# EAGLE design h-Remote (EAGLE 6.3)
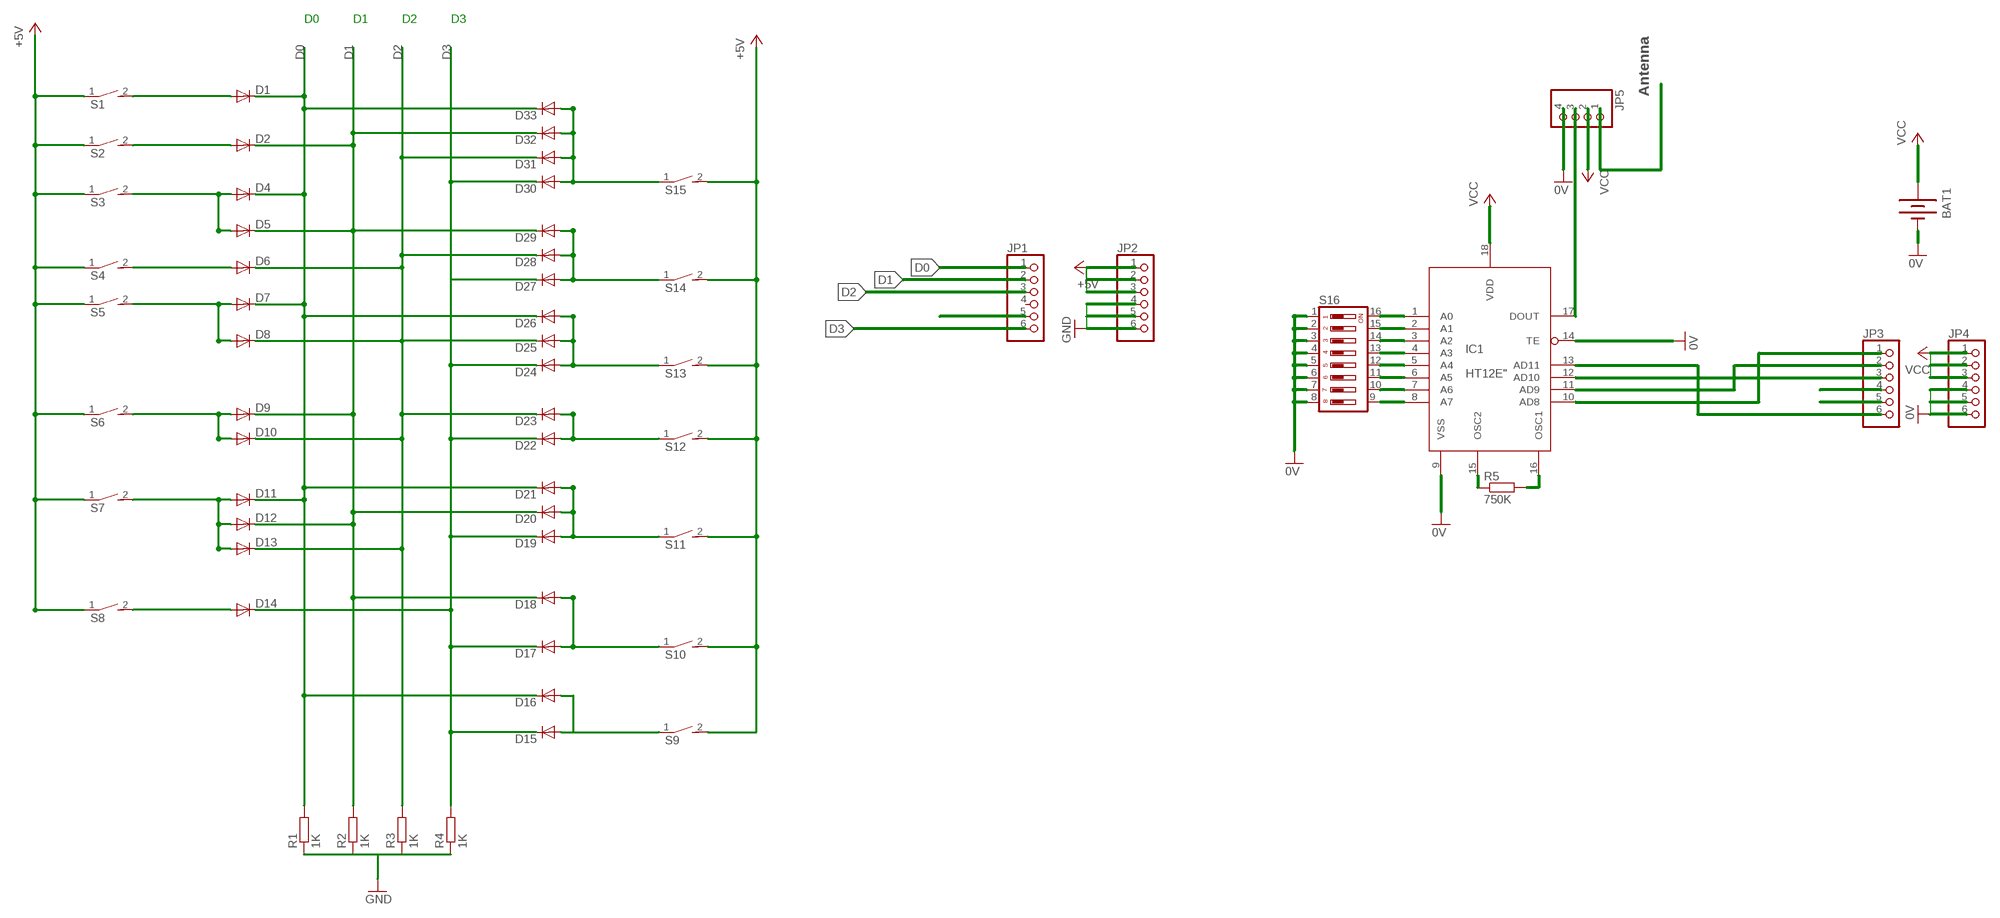
[diagram p0: schematic, sheet 1]

## Parts
BAT1  BATTERY20PTH  [BATTCOM_20MM_PTH]
D1  DIODE-MELF-MLL41  [MELF-MLL41]
D2  DIODE-MELF-MLL41  [MELF-MLL41]
D4  DIODE-MELF-MLL41  [MELF-MLL41]
D5  DIODE-MELF-MLL41  [MELF-MLL41]
D6  DIODE-MELF-MLL41  [MELF-MLL41]
D7  DIODE-MELF-MLL41  [MELF-MLL41]
D8  DIODE-MELF-MLL41  [MELF-MLL41]
D9  DIODE-MELF-MLL41  [MELF-MLL41]
D10  DIODE-MELF-MLL41  [MELF-MLL41]
D11  DIODE-MELF-MLL41  [MELF-MLL41]
D12  DIODE-MELF-MLL41  [MELF-MLL41]
D13  DIODE-MELF-MLL41  [MELF-MLL41]
D14  DIODE-MELF-MLL41  [MELF-MLL41]
D15  DIODE-MELF-MLL41  [MELF-MLL41]
D16  DIODE-MELF-MLL41  [MELF-MLL41]
D17  DIODE-MELF-MLL41  [MELF-MLL41]
D18  DIODE-MELF-MLL41  [MELF-MLL41]
D19  DIODE-MELF-MLL41  [MELF-MLL41]
D20  DIODE-MELF-MLL41  [MELF-MLL41]
D21  DIODE-MELF-MLL41  [MELF-MLL41]
D22  DIODE-MELF-MLL41  [MELF-MLL41]
D23  DIODE-MELF-MLL41  [MELF-MLL41]
D24  DIODE-MELF-MLL41  [MELF-MLL41]
D25  DIODE-MELF-MLL41  [MELF-MLL41]
D26  DIODE-MELF-MLL41  [MELF-MLL41]
D27  DIODE-MELF-MLL41  [MELF-MLL41]
D28  DIODE-MELF-MLL41  [MELF-MLL41]
D29  DIODE-MELF-MLL41  [MELF-MLL41]
D30  DIODE-MELF-MLL41  [MELF-MLL41]
D31  DIODE-MELF-MLL41  [MELF-MLL41]
D32  DIODE-MELF-MLL41  [MELF-MLL41]
D33  DIODE-MELF-MLL41  [MELF-MLL41]
IC1  HT12E"  [18-DIP-A]
JP1  PINHD-1X6  [1X06]
JP2  PINHD-1X6  [1X06]
JP3  PINHD-1X6  [1X06]
JP4  PINHD-1X6  [1X06]
JP5  PINHD-1X4  [1X04]
R1  1K  R-EU_R1206  [R1206]
R2  1K  R-EU_R1206  [R1206]
R3  1K  R-EU_R1206  [R1206]
R4  1K  R-EU_R1206  [R1206]
R5  750K  R-EU_0207/10  [0207/10]
S1  DS01E  [DS-01]
S2  DS01E  [DS-01]
S3  DS01E  [DS-01]
S4  DS01E  [DS-01]
S5  DS01E  [DS-01]
S6  DS01E  [DS-01]
S7  DS01E  [DS-01]
S8  DS01E  [DS-01]
S9  DS01E  [DS-01]
S10  DS01E  [DS-01]
S11  DS01E  [DS-01]
S12  DS01E  [DS-01]
S13  DS01E  [DS-01]
S14  DS01E  [DS-01]
S15  DS01E  [DS-01]
S16  DIP08YL  [DIP08YL]

## Nets
0V: BAT1.2(-) IC1.9(VSS) IC1.14(TE) JP4.4 JP4.5 JP4.6 JP5.4 S16.1 S16.2 S16.3 S16.4 S16.5 S16.6 S16.7 S16.8
+5V: JP2.1 JP2.2 JP2.3 S1.1 S2.1 S3.1 S4.1 S5.1 S6.1 S7.1 S8.1 S9.2 S10.2 S11.2 S12.2 S13.2 S14.2 S15.2
D0: D1.C D4.C D7.C D11.C D16.C D21.C D26.C D33.C JP1.1 R1.2
D1: D2.C D5.C D9.C D12.C D18.C D20.C D29.C D32.C JP1.2 R2.2
D2: D6.C D8.C D10.C D13.C D23.C D25.C D28.C D31.C JP1.3 R3.2
D3: D14.C D15.C D17.C D19.C D22.C D24.C D27.C D30.C JP1.6 R4.2
GND: JP2.4 JP2.5 JP2.6 R1.1 R2.1 R3.1 R4.1
N$2: D7.A D8.A S5.2
N$3: IC1.13(AD11) JP3.6
N$4: IC1.12(AD10) JP3.3
N$5: D2.A S2.2
N$6: IC1.11(AD9) JP3.2
N$7: D6.A S4.2
N$8: D4.A D5.A S3.2
N$9: D1.A S1.2
N$10: D9.A D10.A S6.2
N$11: D11.A D12.A D13.A S7.2
N$12: D14.A S8.2
N$13: D15.A D16.A S9.1
N$14: D17.A D18.A S10.1
N$15: D19.A D20.A D21.A S11.1
N$16: D22.A D23.A S12.1
N$17: D24.A D25.A D26.A S13.1
N$18: D27.A D28.A D29.A S14.1
N$19: D30.A D31.A D32.A D33.A S15.1
N$20: IC1.10(AD8) JP3.1
N$21: IC1.1(A0) S16.16
N$22: IC1.2(A1) S16.15
N$23: IC1.3(A2) S16.14
N$24: JP1.5
N$25: IC1.4(A3) S16.13
N$26: IC1.5(A4) S16.12
N$31: IC1.6(A5) S16.11
N$32: IC1.7(A6) S16.10
N$33: IC1.8(A7) S16.9
N$36: IC1.15(OSC2) R5.1
N$37: IC1.16(OSC1) R5.2
N$42: JP3.4
N$43: JP3.5
N$52: IC1.17(DOUT) JP5.3
N$54: JP5.1
VCC: BAT1.1(+) IC1.18(VDD) JP4.1 JP4.2 JP4.3 JP5.2
Unconnected: JP1.4

## Notes on the sheet
- D0 | D1 | D2 | D3
- Antenna

## Library data of the parts
BAT1 = SparkFun-Electromechanical:BATTERY: Battery Holders Various common sizes : AA, AAA, 18650 (PRT-12895), 20mm coin cell and 12mm coin cell. 20MM_4LEGS, BATT-10373
D1 D2 D4-D33 = diode:DIODE-: DIODE
IC1 = holtek1:HT12E: transmitter = encoder ic
JP1-JP4 = pinhead:PINHD-1X6: PIN HEADER
JP5 = pinhead:PINHD-1X4: PIN HEADER
R1-R5 = rcl:R-EU_: RESISTOR, European symbol
S1-S15 = switch-dil:DS01E: DIL/CODE SWITCH; OC_FARNELL: unknown; OC_NEWARK: unknown
S16 = switch-dil:DIP08YL: DIL/CODE SWITCH; OC_FARNELL: unknown; OC_NEWARK: unknown

## Board
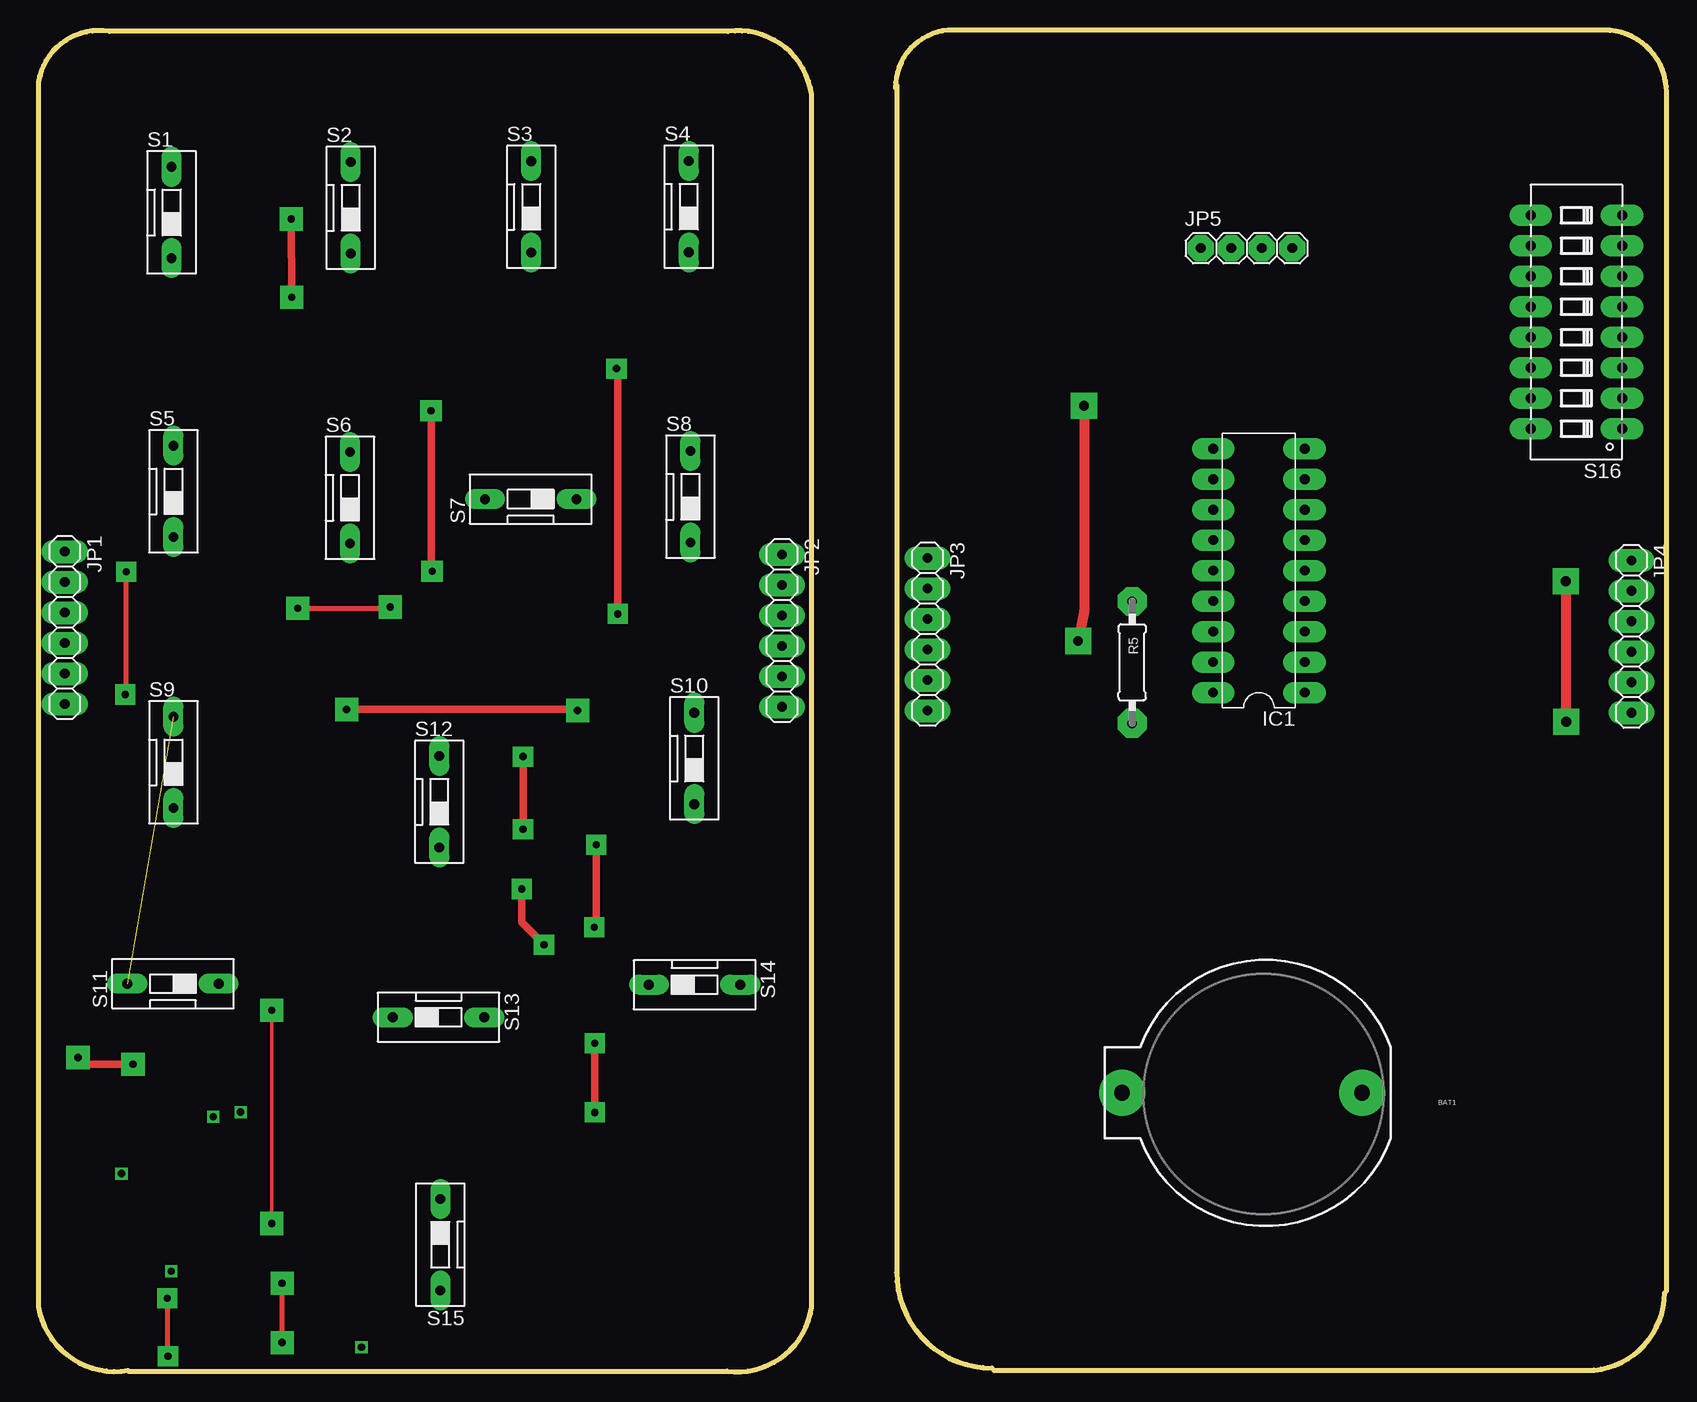
[diagram p1: board, top side]
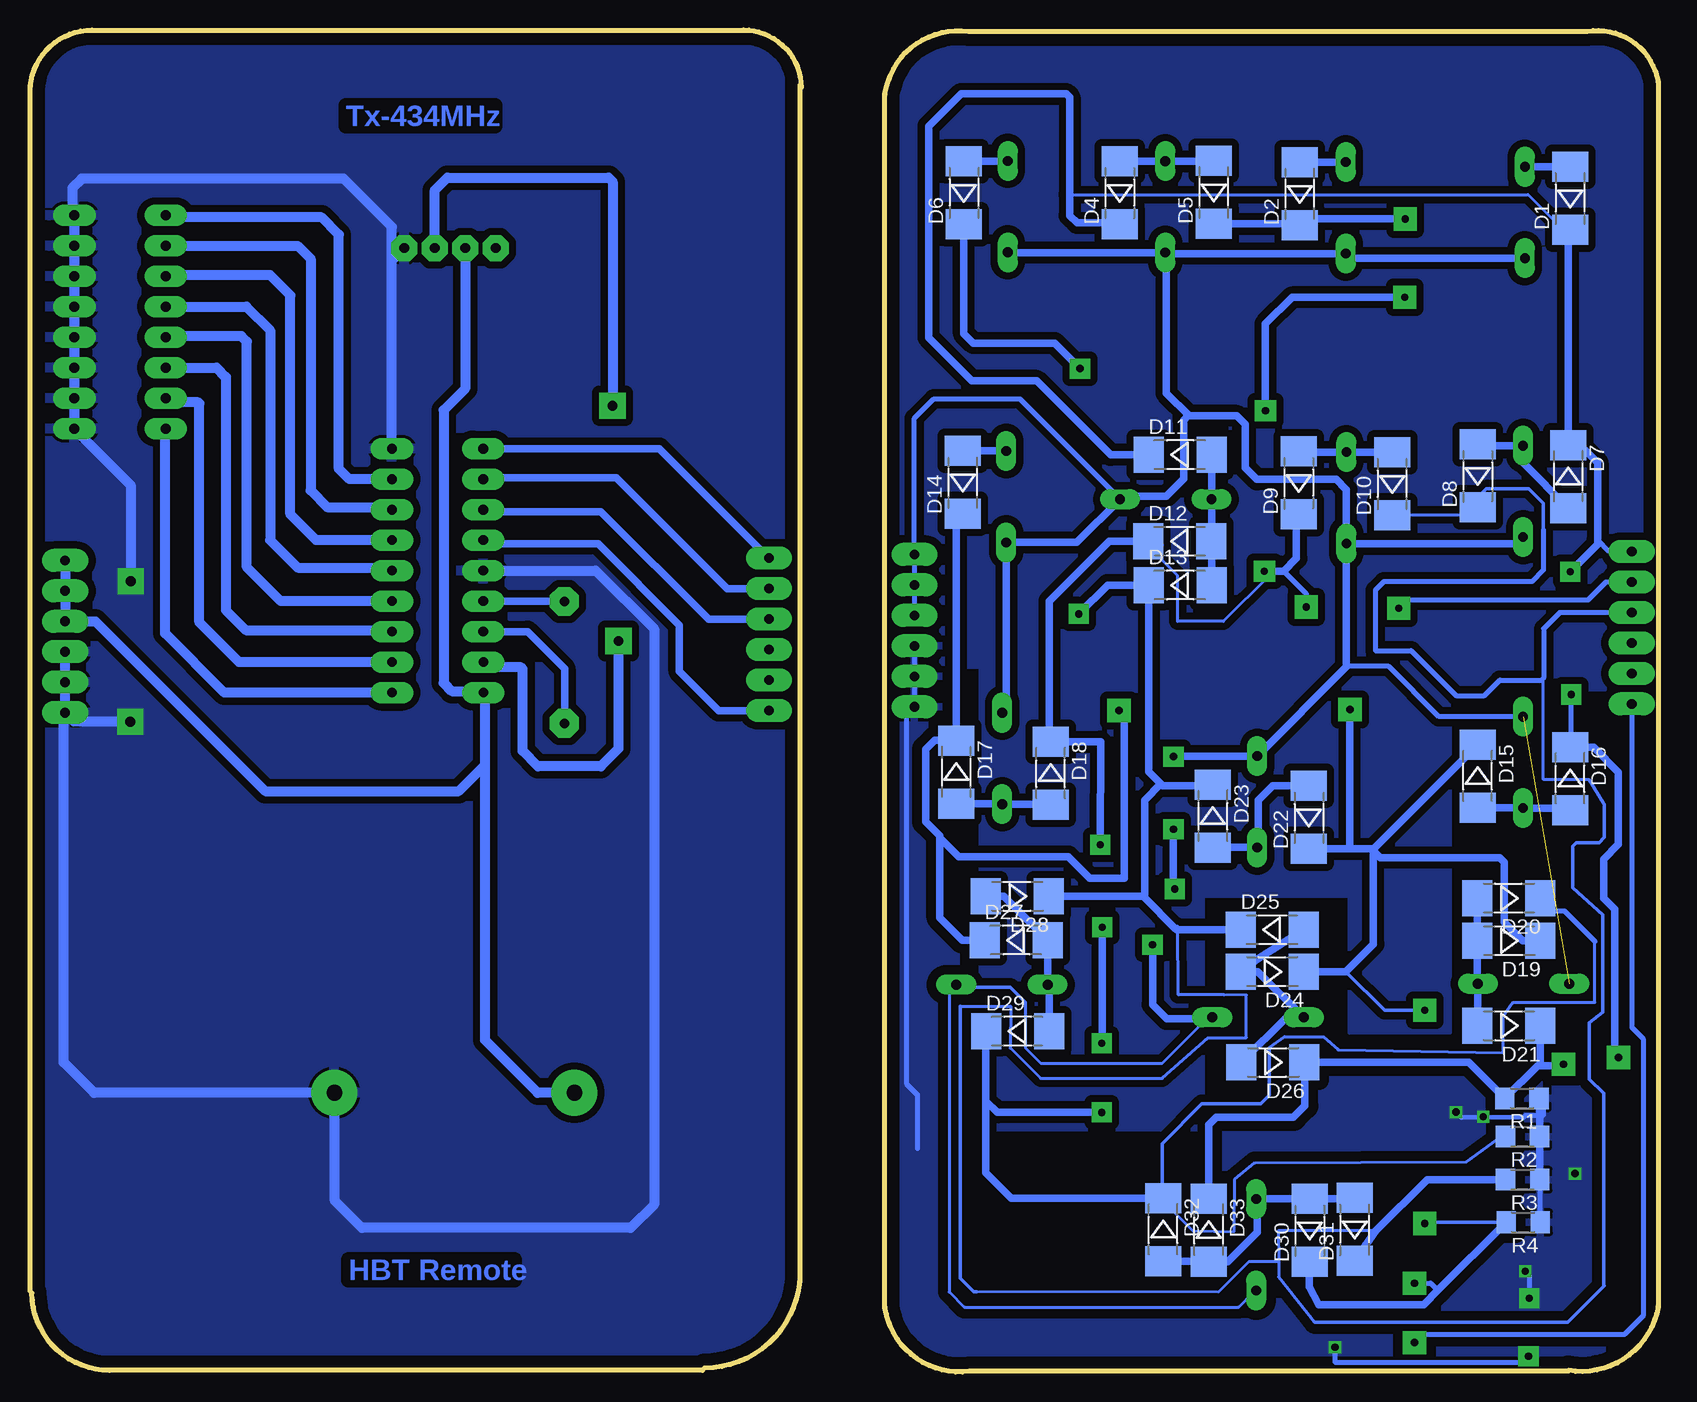
[diagram p2: board, bottom side, seen from below]

Size 135.68 x 111.82 mm. Coordinates in mm from the lower left corner, seen from the top.
Outline: 7.47,0.05 57.39,0.05 arc90 64.43,5.4 64.43,106.45 arc90 57.48,111.7 5.9,111.7 arc90 0,107.51 0,5.43 arc90 7.48,0.11
Outline: 71.51,107.25 71.51,8.27 arc90 79.46,0.32
Outline: 79.62,0.12 129.04,0.12 arc90 135.51,6.58
Outline: 135.67,6.74 135.67,106.64 arc90 130.5,111.82 76.22,111.82 arc90 71.41,107.01
Copper layers (1*16): Top 0.035mm / dielectric 1.5mm / Bottom 0.035mm
Design rules "default": minimum track width 10mil, minimum drill 24mil, track to track 8mil, track to pad 8mil, pad to pad 8mil, via to via 8mil, smd to smd 8mil, copper to edge 40mil, drill to drill 8mil, minimum pad ring 10mil, minimum via ring 8mil, stop-mask expansion 4mil, vias tented up to drill 0mil, thermal gap 10mil

### Footprints (pad centres in the part's own frame; a part is rotated, then mirrored left to right if it is on the bottom)
BATTCOM_20MM_PTH = drill 1.3 pad 3.81: 1 11.85,0; 2 -8.15,0
MELF-MLL41 = smd 2.5 x 3: A 2.625,0; C -2.625,0
18-DIP-A = drill 0.813 pad 1.778 long: 1 -10.16,-3.81; 2 -7.62,-3.81; 3 -5.08,-3.81; 4 -2.54,-3.81; 5 0,-3.81; 6 2.54,-3.81; 7 5.08,-3.81; 8 7.62,-3.81; 9 10.16,-3.81; 10 10.16,3.81; 11 7.62,3.81; 12 5.08,3.81; 13 2.54,3.81; 14 0,3.81; 15 -2.54,3.81; 16 -5.08,3.81 | drill 0.8 pad 1.778 long: 17 -7.62,3.81; 18 -10.16,3.81
1X06 = drill 0.8 pad 1.93 long: 1 -6.35,0; 2 -3.81,0; 3 -1.27,0; 4 1.27,0; 5 3.81,0; 6 6.35,0
1X04 = drill 0.8 pad 2.184 octagon: 1 -3.81,0; 2 -1.27,0; 3 1.27,0; 4 3.81,0
R1206 = smd 1.6 x 1.803: 1 -1.422,0; 2 1.422,0
0207/10 = drill 0.8 pad 2.4 octagon: 1 -5.08,0; 2 5.08,0
DS-01 = drill 0.813 pad 1.676 long: 1 0,-3.81; 2 0,3.81
DIP08YL = drill 0.813 pad 1.778 long: 1 -8.89,-3.81; 2 -6.35,-3.81; 3 -3.81,-3.81; 4 -1.27,-3.81; 5 1.27,-3.81; 6 3.81,-3.81; 7 6.35,-3.81; 8 8.89,-3.81; 9 8.89,3.81; 10 6.35,3.81; 11 3.81,3.81; 12 1.27,3.81; 13 -1.27,3.81; 14 -3.81,3.81; 15 -6.35,3.81; 16 -8.89,3.81

### Placement (x,y rotation side)
BAT1  102.16,23.25 180 top
D1  7.34,97.8 90 bottom
D2  29.87,98.18 90 bottom
D4  44.86,98.25 90 bottom
D5  37.04,98.3 90 bottom
D6  57.84,98.27 90 bottom
D7  7.47,74.6 270 bottom
D8  15.03,74.66 90 bottom
D9  29.94,74.08 90 bottom
D10  22.17,74.01 90 bottom
D11  39.83,76.42 0 bottom
D12  39.85,69.21 0 bottom
D13  39.84,65.56 0 bottom
D14  57.95,74.13 90 bottom
D15  15.04,49.63 270 bottom
D16  7.33,49.43 270 bottom
D17  58.47,49.97 270 bottom
D18  50.62,49.87 270 bottom
D19  12.43,35.93 180 bottom
D20  12.45,39.48 180 bottom
D21  12.45,28.84 180 bottom
D22  29.1,46.21 90 bottom
D23  37.09,46.31 270 bottom
D24  32.17,33.36 180 bottom
D25  32.15,36.83 0 bottom
D26  32.1,25.79 180 bottom
D27  53.5,35.98 0 bottom
D28  53.41,39.63 180 bottom
D29  53.38,28.38 0 bottom
D30  29.03,11.79 90 bottom
D31  25.3,11.87 90 bottom
D32  41.24,11.85 270 bottom
D33  37.45,11.81 270 bottom
IC1  101.71,66.77 90 top
JP1  2.19,62 270 top
JP2  61.97,61.77 270 top
JP3  74.1,61.45 270 top
JP4  132.74,61.28 270 top
JP5  100.67,93.64 0 top
R1  11.35,22.79 180 bottom
R2  11.3,19.61 180 bottom
R3  11.29,16.01 180 bottom
R4  11.24,12.46 180 bottom
R5  91.15,59.12 270 top
S1  11.1,96.62 0 top
S2  26.03,97 0 top
S3  41.06,97.08 0 top
S4  54.19,97.1 0 top
S5  11.26,73.37 0 top
S6  25.97,72.84 0 top
S7  41.02,72.73 90 top
S8  54.33,72.93 0 top
S9  11.25,50.79 0 top
S10  54.66,51.12 0 top
S11  11.21,32.35 90 top
S12  33.41,47.5 0 top
S13  33.34,29.54 270 top
S14  54.68,32.26 270 top
S15  33.49,10.59 180 top
S16  128.17,87.49 90 top

### Tracks (layer width: path | path; a pad name or v marks a point on that pad's centre or on a via)
0V  (via drill 0.8 pad 2.18)
  Top 0.813: v127.28,65.88 127.28,54.17 v127.32,54.17
  Bottom 0.813: JP4.6 JP4.5 JP4.4 | IC1.9 105.52,92.61 | 105.52,92.61 JP5.4 | 105.52,92.61 105.52,95.41 109.54,99.43 131.38,99.43 132.15,98.67 132.15,96.55 S16.8 S16.7 S16.6 S16.5 S16.4 S16.3 S16.2 S16.1 127.28,73.9 v127.28,65.88 | JP4.6 132.86,54.81 132.86,25.78 130.34,23.25 BAT1.2 110.27,23.2 110.27,14.24 108.01,11.99 85.62,11.99 83.67,13.93 83.67,61.91 88.53,66.77 IC1.14 | v127.32,54.17 131.99,54.17 JP4.6
  pour Bottom (isolate 0.61): 71.65,106.94 71.65,8.06 arc90 79.4,0.32 129.35,0.32 arc90 135.32,6.29 135.32,107.05 arc90 130.46,111.91 76.49,111.91 arc90 71.58,107
+5V  (via drill 0.6 pad 1.68)  (1 unrouted)
  Top 0.61: v40.39,51.27 v40.39,45.2 | v40.28,40.24 40.28,37.45 v42.13,35.6
  Bottom 0.254: S15.2 33.68,6.67 34.95,5.4 57.81,5.4 59.08,6.67 59.08,32.07 S14.2 57.81,32.07 | 52.73,30.79 52.73,26.99 51.46,25.72 41.3,25.72 37.49,29.53 S13.2
  Bottom 0.305: 57.81,32.07 54.01,32.07 52.73,30.79
  Bottom 0.406: S9.2 18.26,54.6 22.45,58.79 25.93,58.79 25.97,58.75 | S7.1 53.18,81.07 60.34,81.07 61.97,79.44 JP2.1 JP2.2 JP2.3
  Bottom 0.61: S1.1 25.64,92.81 S2.1 40.99,93.19 | 40.99,93.19 S3.1 54.17,93.27 S4.1 | S6.1 11.79,69.03 S5.1 | S6.1 25.97,73.51 26.84,74.37 33.44,74.37 34.42,75.35 34.42,78.98 35.1,79.66 39.08,79.66 | 39.08,79.66 39.21,79.66 39.55,79.32 39.55,74.41 40.98,72.98 44.58,72.98 S7.1 48.44,69.12 S8.1 54.33,55.25 S10.2 | S6.1 25.97,58.75 S12.2 40.34,51.31 v40.39,51.27 | S9.2 11.6,54.95 | 40.99,93.19 40.99,81.56 39.08,79.66 | v40.39,45.2 40.39,40.35 v40.28,40.24 | v42.13,35.6 42.13,30.59 40.95,29.41 37.29,29.41 S13.2
D0  (via drill 0.6 pad 1.68, 0.6 pad 1.93)
  Top 0.406: v7.24,56.44 7.33,56.44 v7.33,66.66
  Top 0.61: v3.3,26.2 3.86,25.64 v7.88,25.64
  Bottom 0.254: 49.03,98.11 10.82,98.11 8.28,95.57 D1.C
  Bottom 0.406: D16.C 7.24,52.06 v7.24,56.44 | JP1.1 4.06,68.35 5.03,69.33
  Bottom 0.61: D1.C 7.47,95.05 D7.C 6.5,77.23 5.03,75.76 5.03,69.33 5.03,69.13 4.95,69.05 v7.33,66.66 | D21.C 9.82,25.74 10.04,25.51 | 10.04,25.51 R1.2 15.76,25.79 D26.C 29.43,25.74 29.43,22.16 30.39,21.2 36.82,21.2 37.45,20.57 D33.C | D11.C 45.63,76.42 51.8,82.59 57.19,82.59 60.78,86.19 60.78,103.8 58.09,106.5 49.33,106.5 49.03,106.2 49.03,98.11 49.03,96.36 48.41,95.74 44.97,95.74 D4.C | D16.C 5.38,52.06 3.3,49.98 3.3,43.96 4.55,42.72 4.55,39.47 3.62,38.54 3.62,26.51 v3.3,26.2 | v7.88,25.64 8.01,25.51 10.04,25.51
D1  (via drill 0.6 pad 1.68, 0.6 pad 1.78, 0.6 pad 1.93)
  Top 0.406: v21.6,63.63 29.21,63.63 v29.32,63.74
  Top 0.61: v21.08,96.07 v21.1,89.54 | v32.72,80.09 32.72,66.8 v32.81,66.71 | v46.5,43.93 46.5,37.22 v46.31,37.04 | v46.37,27.38 v46.37,21.62
  Bottom 0.254: D12.C 41.3,68.9 41.3,67.63 40.03,66.36 40.03,62.55 36.22,62.55 32.41,66.36 v32.81,66.71 | R2.2 13.36,19.37 15.95,17.52 33.61,17.4 35.27,16.06 35.34,11.68 38.76,11.75 41.3,14.29 D32.C | 5.26,35.88 5.26,30.8 12.09,30.8 12.91,29.68 12.91,26.6 26.66,26.84 27.9,27.91 31.11,27.94 32.41,26.99 | 9.55,38.42 D20.C | 45.11,14.29 45.11,14.47
  Bottom 0.305: 32.41,26.99 32.41,23.05 33.13,22.33 38.03,22.33 41.34,19.02 41.34,14.56 D32.C
  Bottom 0.406: JP1.2 4.35,65.81 5.86,64.3 20.93,64.3 v21.6,63.63 | v29.32,63.74 29.32,64.82 31.21,66.71 | 9.55,38.42 7.8,38.42 5.26,35.88
  Bottom 0.61: D5.C 29.87,95.68 D2.C 29.36,96.07 v21.08,96.07 | D32.C 45.11,14.47 53.91,14.47 56.02,16.58 56.02,22.55 | 56.02,22.55 56.02,28.37 D29.C | D12.C 45.74,69.21 50.73,64.22 50.73,52.61 D18.C 47.9,52.5 46.45,52.51 v46.49,43.92 v46.5,43.93 | v21.1,89.54 30.51,89.54 32.72,87.32 v32.72,80.09 | v32.81,66.71 31.21,66.71 30.14,67.78 30.14,71.26 D9.C | v46.31,37.04 46.31,27.44 v46.37,27.38 | v46.37,21.62 55.09,21.62 56.02,22.55
D2  (via drill 0.6 pad 1.68)
  Top 0.61: v48.28,63.16 48.28,83.5 v48.17,83.61
  Bottom 0.254: D10.C 20.98,71.44 15.9,71.44 D8.C 14.63,71.44 | 9.55,57.81 9.55,49.35 5.74,49.35 4.47,47.31 | 28.6,4.13 31.62,7.91 31.62,9.18 | 31.62,9.18 31.67,11.75 23.52,11.75 23.52,11.74 | 58.17,30.47 53.96,30.47 54,26.99 51.46,24.45 41.3,24.45 37.49,27.82 34.31,27.84 34.31,31.39 36.16,31.42 39.97,31.42 40.03,37.15 40.24,36.94 | 56.78,6.67 36.64,6.64 34.1,9.18 31.62,9.18
  Bottom 0.305: 28.6,4.13 7.53,4.13 4.47,7.19 4.54,7.26 4.54,23.2 5.73,24.39 5.73,29.07 4.62,29.94 4.62,38.07 7.12,40.34 7.12,43.8 6.81,44.11 4.91,44.11 4.47,44.54 4.47,47.31 | 58.17,30.47 58.17,30.46 58.17,7.8 57.04,6.67 56.78,6.67 | 9.55,70.17 9.55,72.36 10.76,73.57 14.34,73.57 15.03,72.89 D8.C
  Bottom 0.406: 9.55,70.17 9.55,66.83 10.53,65.86 22.85,65.86 23.56,65.15 23.56,60.09 20.57,60.09 16.82,56.35 14.49,56.35 13.18,57.65 9.71,57.65 9.55,57.81 9.54,57.82 9.54,61.94 8.21,63.27 JP1.3
  Bottom 0.61: D31.C 23.52,11.74 19.25,16.01 R3.2 | 41.45,48.99 42.46,50 D13.C 45.88,65.56 v48.28,63.16 | 41.45,48.99 41.3,48.84 37.19,48.84 D23.C | D25.C 40.13,36.83 40.24,36.94 42.79,39.49 42.79,39.7 | 42.79,39.7 42.79,47.64 41.45,48.99 | D28.C 42.86,39.63 42.79,39.7 | v48.17,83.61 50.28,85.72 57.05,85.72 57.84,86.51 D6.C
D3  (via drill 0.6 pad 1.93)
  Top 0.305: v19.44,12.36 v19.44,30.12
  Top 0.406: v20.31,2.44 v20.31,7.38
  Top 0.61: v25.68,55.2 44.93,55.2 v44.93,55.11
  Bottom 0.305: R4.2 19.34,12.46 v19.44,12.36 | v19.44,30.12 22.78,30.12 26.02,33.36
  Bottom 0.406: JP1.6 2.19,28.71 1.24,27.76 1.24,4.67 2.78,3.13 19.42,3.13 20.21,2.34 v20.31,2.44 | v20.31,7.38 18.95,7.38 18.35,6.78
  Bottom 0.61: R4.2 18.35,6.78 19.53,5.6 28.29,5.6 29.06,7.08 D30.C | D14.C 58.47,70.99 D17.C 58.52,52.64 60.3,52.64 61.04,51.9 61.04,45.83 59.86,44.65 59.86,44.51 | D15.C 23.73,43.56 | D24.C 26.02,33.36 23.73,35.65 23.73,43.41 | 23.73,43.41 23.73,43.56 | D19.C 11.29,35.93 12.83,37.47 12.83,42.49 13.2,42.86 23.17,42.86 23.73,43.41 | D27.C 58,35.98 59.86,37.84 59.86,44.51 | D22.C 25.68,43.59 | 25.68,43.59 v25.68,55.2 | v44.93,55.11 44.5,55.11 44.5,41.14 47.36,41.14 49.15,42.93 58.29,42.93 59.86,44.51 | 25.68,43.59 23.75,43.59 23.73,43.56
GND  (via drill 0.6, 0.6 pad 1.68)
  Top 0.406: v10.73,6.12 10.73,1.3 v10.8,1.3
  Bottom 0.406: R3.1 9.86,12.5 R4.1 | 61.73,18.59 61.73,23.11 62.64,24.01 62.64,54.75 JP2.6 JP2.5 JP2.4 | v11.08,8.38 10.73,8.04 v10.73,6.12 | v10.8,1.3 arc90 11.32,0.77 26.85,0.77 arc90 26.92,0.85 v26.92,2.04 | 9.88,22.75 9.56,22.43 9.56,21.4 9.58,21.38 11.04,21.38 11.22,21.2 v14.56,21.25 16.39,21.2 v16.84,21.65
  Bottom 0.61: R3.1 9.86,19.59 R2.1 9.88,22.75 R1.1
  other vias: 6.93,16.52
  pour Bottom (isolate 0.813): -0.01,111.75 64.41,111.75 64.41,-0.1 0.07,-0.1 0.07,111.75
N$1
  pour Bottom (isolate 0.61): 0.13,106.99 0.13,106.99 arc-90 4.92,111.78 58.36,111.78 arc-90 64.47,105.68 64.47,58.79 56.44,58.79 56.44,20.28 52.13,20.28 37.93,20.28 37.93,39.71 25.72,39.71 25.72,28.33 17.35,28.33 17.35,56.91 0.11,56.91 0.11,107.08
N$2
  Bottom 0.61: D8.A 15.03,77.18 S5.2 11.26,75.76 D7.A
N$3
  Bottom 0.61: JP3.6 78.29,55.1 81.56,58.37 81.56,62.23 88.33,69 97.59,69 IC1.13
N$4
  Bottom 0.61: JP3.3 79.13,62.72 88.1,71.69 97.74,71.69 IC1.12
N$5
  Bottom 0.61: D2.A S2.2
N$6
  Bottom 0.61: JP3.2 77.58,65.26 86.81,74.49 97.79,74.49 IC1.11
N$7
  Bottom 0.61: D6.A 54.19,100.9 S4.2
N$8
  Bottom 0.61: D4.A S3.2 37.04,100.89 D5.A
N$9
  Bottom 0.61: S1.2 D1.A | D1.A
N$10
  Bottom 0.61: D10.A 25.96,76.63 S6.2 29.89,76.65 D9.A
N$11
  Bottom 0.61: D11.A S7.2 37.21,68.91 | 37.21,68.91 37.21,68.64 | D13.A D12.A 37.22,68.92 37.21,68.91
N$12
  Bottom 0.61: D14.A 54.35,76.76 S8.2
N$13
  Bottom 0.61: D15.A 11.28,47.01 S9.1 7.5,46.98 D16.A
N$14
  Bottom 0.61: D17.A 54.7,47.34 S10.1 50.68,47.3 D18.A
N$15
  Bottom 0.61: D20.A 15.08,35.96 D19.A 15.05,32.38 S11.1 15.02,28.9 D21.A
N$16
  Bottom 0.61: D23.A S12.1 33.32,43.78 33.32,47.63 32.11,48.84 D22.A
N$17
  Bottom 0.61: D25.A 33.38,34.39 D24.A 33.35,33.36 S13.1 30.96,29.54 D26.A
N$18
  Bottom 0.61: D28.A 54.53,39.63 D27.A | D29.A 50.76,32.14 S14.1 D27.A | D27.A
N$19
  Bottom 0.61: D31.A 26.09,14.42 D30.A 29.83,14.4 S15.1 33.41,14.32 33.41,11.62 35.84,9.18 D33.A 37.49,9.22 D32.A
N$20
  Bottom 0.61: JP3.1 83.23,76.93 IC1.10
N$21
  Bottom 0.813: IC1.1 119.47,56.61 124.4,61.54 124.4,78.55 S16.16
N$22
  Bottom 0.813: IC1.2 118.24,59.15 121.55,62.46 121.55,80.69 121.64,80.78 124,80.78 S16.15
N$23
  Bottom 0.813: S16.14 120.13,83.68 119.34,82.9 119.34,63.47 117.69,61.82 105.64,61.82 IC1.3
N$25
  Bottom 0.813: IC1.4 114.76,64.23 117.6,67.06 117.6,85.84 118.06,86.3 124.27,86.3 S16.13
N$26
  Bottom 0.813: S16.12 117.64,88.76 115.67,86.78 115.67,69.31 113.37,67.01 105.76,67.01 IC1.5
N$31
  Bottom 0.813: IC1.6 111.84,69.31 113.98,71.45 113.98,89.7 115.67,91.38 124.27,91.38 S16.11
N$32
  Bottom 0.813: S16.10 113.37,93.84 112.3,92.76 112.3,73.45 110.92,72.07 105.73,72.07 IC1.7
N$33
  Bottom 0.813: IC1.8 109.07,74.39 109.93,75.25 109.93,94.76 111.38,96.21 124.19,96.21 S16.9
N$36
  Bottom 0.61: R5.1 97.87,64.2 IC1.15
N$37
  Bottom 0.61: IC1.16 94.21,61.69 91.13,58.61 91.13,54.06 R5.2
N$52  (via drill 0.8 pad 2.18)
  Top 0.813: v87.13,80.5 87.13,63.41 v86.64,60.89
  Bottom 0.813: JP5.3 101.94,98.47 100.89,99.52 87.46,99.52 87.13,99.19 v87.13,80.5 | v86.64,60.89 86.64,51.93 88.11,50.46 93.35,50.46 94.62,51.74 94.62,58.58 94.75,58.7 97.45,58.7 IC1.17
VCC
  Bottom 0.813: JP4.1 JP4.2 JP4.3 130.23,62.55 116.06,48.38 99.95,48.38 97.76,50.58 | JP5.2 99.4,81.93 101.2,80.14 101.2,57.41 100.52,56.72 98.01,56.72 IC1.18 97.76,56.47 97.76,50.58 | BAT1.1 93.37,23.25 97.76,27.64 97.76,50.58

### Text on the board
Bottom: Tx-434MHz | HBT Remote